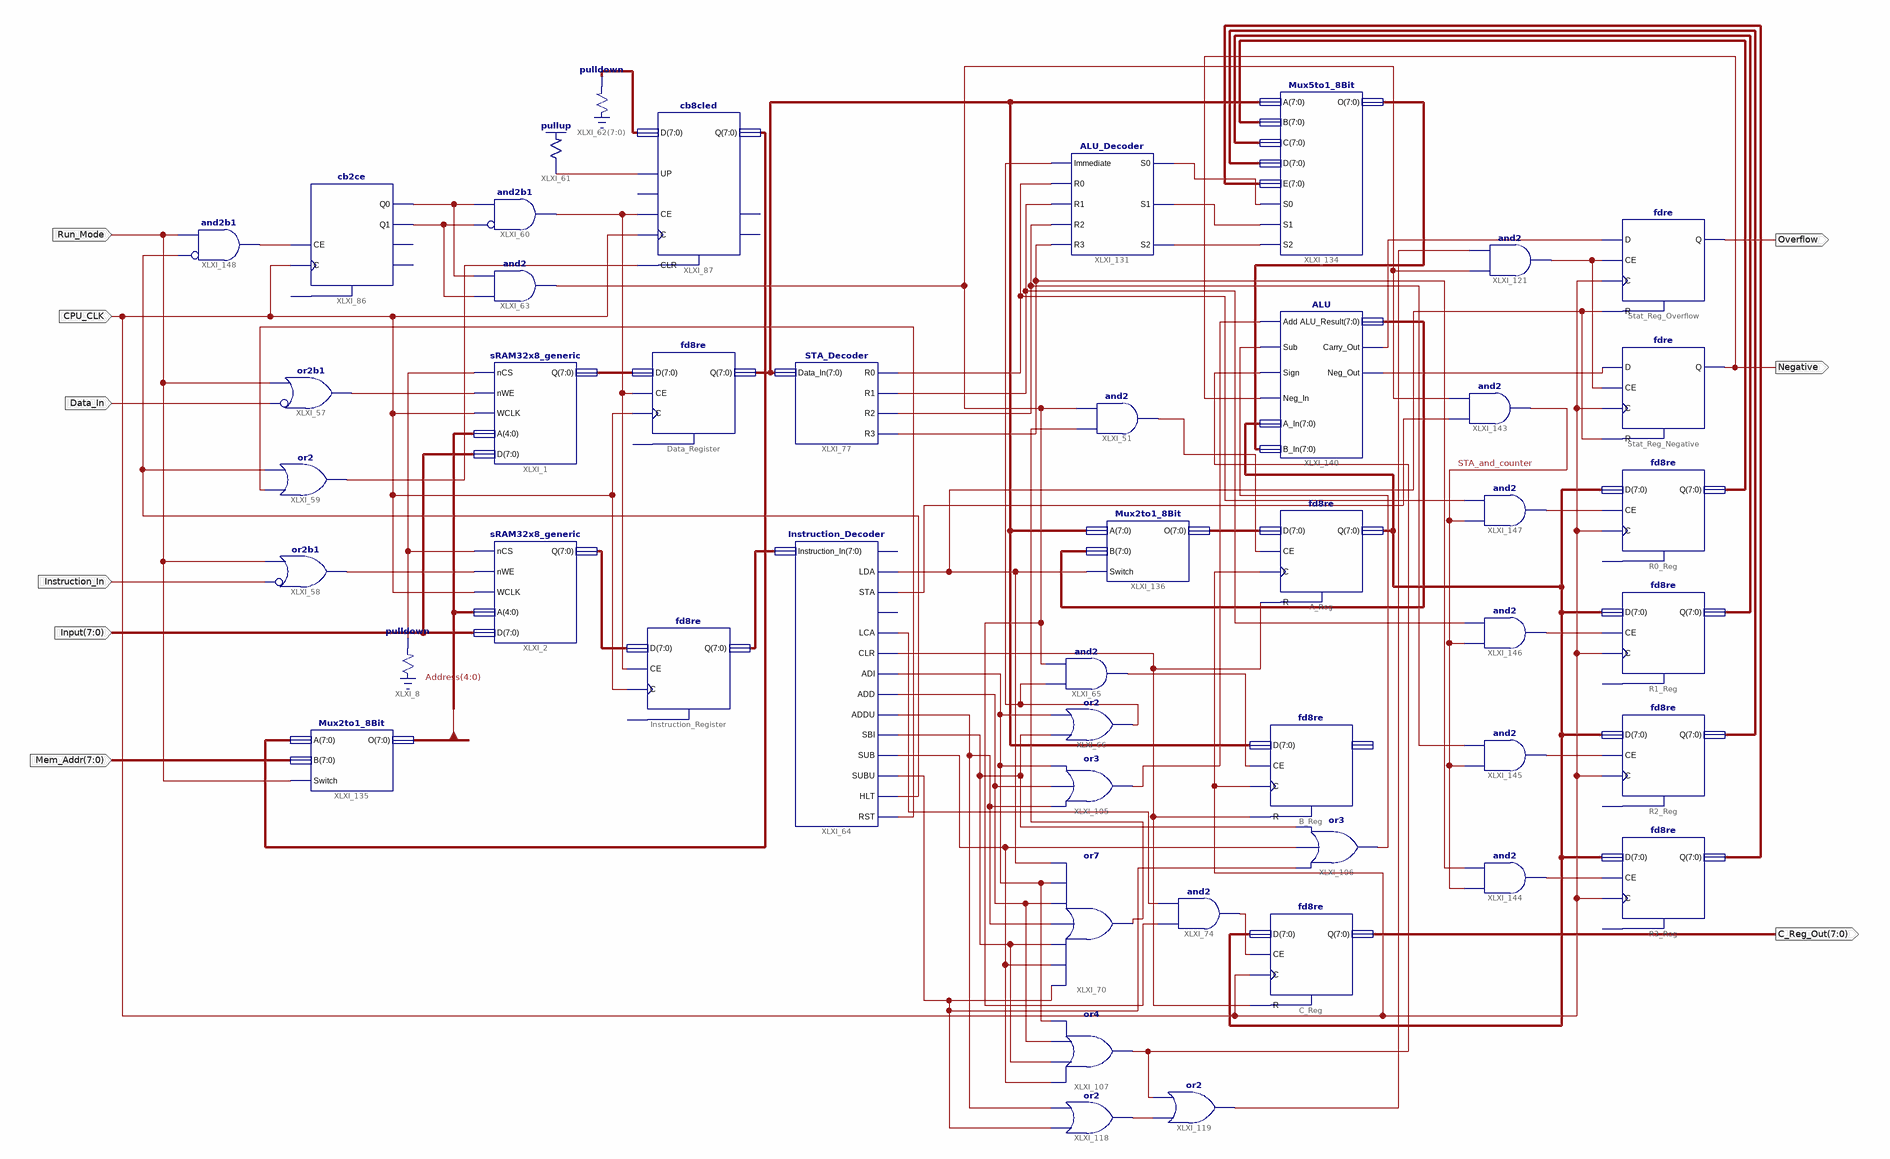
[diagram p0: schematic sheet 1]
// Xilinx ISE schematic CPU.sch (spartan3e) as structural Verilog: 47 symbols, 10 ports
module CPU (
  input  [7:0] Input,
  input  Instruction_In,
  input  Data_In,
  input  [7:0] Mem_Addr,
  input  Run_Mode,
  input  CPU_CLK,
  output [7:0] C_Reg_Out,
  output Overflow,
  output Negative,
  output XLXN_1065
);

  wire CPUCLK, S1, S2, STA_and_counter, XLXN_15, XLXN_16, XLXN_19, XLXN_50, XLXN_89, XLXN_95, XLXN_102,
       XLXN_103, XLXN_112, XLXN_113, XLXN_199, XLXN_200, XLXN_201, XLXN_202, XLXN_207, XLXN_210, XLXN_380,
       XLXN_449, XLXN_774, XLXN_805, XLXN_806, XLXN_807, XLXN_808, XLXN_809, XLXN_811, XLXN_825, XLXN_841,
       XLXN_842, XLXN_846, XLXN_848, XLXN_905, XLXN_939, XLXN_940, XLXN_941, XLXN_943, XLXN_971, XLXN_991,
       XLXN_992, XLXN_1018, XLXN_1023, XLXN_1053, XLXN_1059;
  wire [7:0] Address, Aout, Data_Out, O, To_ALU, XLXN_1, XLXN_2, XLXN_105, XLXN_802, XLXN_844, XLXN_933,
       XLXN_1049, XLXN_1051, XLXN_1087, XLXN_1090;

  fd8re B_Reg (.C(CPU_CLK), .CE(XLXN_207), .D(Data_Out), .R(XLXN_50));  // open: Q
  fd8re R1_Reg (.C(CPU_CLK), .CE(XLXN_201), .D(Aout), .Q(XLXN_1087));  // open: R
  and XLXI_51 (XLXN_199, XLXN_774, XLXN_1018);
  fd8re R0_Reg (.C(CPU_CLK), .CE(XLXN_200), .D(Aout), .Q(XLXN_1049));  // open: R
  fd8re R2_Reg (.C(CPU_CLK), .CE(XLXN_202), .D(Aout), .Q(XLXN_1051));  // open: R
  fd8re R3_Reg (.C(CPU_CLK), .CE(CPUCLK), .D(Aout), .Q(XLXN_1090));  // open: R
  \pulldown  XLXI_8 (.O(XLXN_19));
  or XLXI_57 (XLXN_15, ~Data_In, Run_Mode);  // or2b1
  or XLXI_58 (XLXN_16, ~Instruction_In, Run_Mode);  // or2b1
  STA_Decoder XLXI_77 (.Data_In(Data_Out), .R0(XLXN_940), .R3(XLXN_943), .R1(XLXN_941), .R2(XLXN_971));
  Mux5to1_8Bit XLXI_134 (
    .S0(XLXN_1065), .S1(S1), .S2(S2), .O(To_ALU), .E(XLXN_1090), .B(XLXN_1049), .C(XLXN_1087), .D(XLXN_1051),
    .A(Data_Out));
  ALU_Decoder XLXI_131 (
    .Immediate(XLXN_939), .R0(XLXN_940), .R1(XLXN_941), .R2(XLXN_971), .R3(XLXN_943), .S1(S1),
    .S0(XLXN_1065), .S2(S2));
  Instruction_Decoder XLXI_64 (
    .Instruction_In(XLXN_802), .RST(XLXN_811), .STA(XLXN_1059), .LCA(XLXN_992), .CLR(XLXN_50),
    .ADI(XLXN_380), .LDA(XLXN_1053), .ADD(XLXN_805), .ADDU(XLXN_806), .SUBU(XLXN_809), .HLT(XLXN_991),
    .SBI(XLXN_807), .SUB(XLXN_808));  // open: NOP, MVI
  and XLXI_65 (XLXN_207, XLXN_939, XLXN_1018);
  or XLXI_66 (XLXN_939, XLXN_807, XLXN_380);
  and XLXI_121 (XLXN_1023, XLXN_1018, XLXN_825);
  fdre Stat_Reg_Negative (.C(CPU_CLK), .CE(XLXN_1023), .D(XLXN_848), .R(XLXN_1053), .Q(Negative));
  fdre Stat_Reg_Overflow (.C(CPU_CLK), .CE(XLXN_1023), .D(XLXN_846), .R(XLXN_1053), .Q(Overflow));
  fd8re A_Reg (.C(CPU_CLK), .CE(XLXN_199), .D(O), .R(XLXN_50), .Q(Aout));
  or XLXI_59 (XLXN_95, XLXN_811, XLXN_991);
  or XLXI_106 (XLXN_841, XLXN_809, XLXN_808, XLXN_807);
  and XLXI_63 (XLXN_1018, XLXN_112, XLXN_113);
  and XLXI_60 (XLXN_102, ~XLXN_112, XLXN_113);  // and2b1
  \pullup  XLXI_61 (.O(XLXN_103));
  \pulldown  XLXI_62[7:0] (.O(XLXN_105));
  or XLXI_105 (XLXN_905, XLXN_806, XLXN_805, XLXN_380);
  or XLXI_70 (XLXN_774, XLXN_809, XLXN_808, XLXN_807, XLXN_806, XLXN_805, XLXN_380, XLXN_1053);
  or XLXI_107 (XLXN_842, XLXN_808, XLXN_807, XLXN_805, XLXN_380);
  or XLXI_118 (XLXN_449, XLXN_809, XLXN_806);
  or XLXI_119 (XLXN_825, XLXN_449, XLXN_842);
  and XLXI_74 (XLXN_210, XLXN_1018, XLXN_992);
  fd8re C_Reg (.C(CPU_CLK), .CE(XLXN_210), .D(Aout), .R(XLXN_50), .Q(C_Reg_Out));
  cb2ce XLXI_86 (.C(CPU_CLK), .CE(XLXN_89), .Q0(XLXN_113), .Q1(XLXN_112));  // open: CLR, CEO, TC
  cb8cled XLXI_87 (
    .C(CPU_CLK), .CE(XLXN_102), .CLR(XLXN_95), .D(XLXN_105), .UP(XLXN_103), .Q(XLXN_933));  // open: L, CEO, TC
  sRAM32x8_generic XLXI_1 (.nCS(XLXN_19), .nWE(XLXN_15), .WCLK(CPU_CLK), .A(Address[4:0]), .D(Input), .Q(XLXN_1));
  sRAM32x8_generic XLXI_2 (.nCS(XLXN_19), .nWE(XLXN_16), .WCLK(CPU_CLK), .A(Address[4:0]), .D(Input), .Q(XLXN_2));
  fd8re Instruction_Register (.C(CPU_CLK), .CE(XLXN_102), .D(XLXN_2), .Q(XLXN_802));  // open: R
  fd8re Data_Register (.C(CPU_CLK), .CE(XLXN_102), .D(XLXN_1), .Q(Data_Out));  // open: R
  Mux2to1_8Bit XLXI_135 (.B(Mem_Addr), .O(Address), .Switch(Run_Mode), .A(XLXN_933));
  Mux2to1_8Bit XLXI_136 (.B(XLXN_844), .O(O), .Switch(XLXN_1053), .A(Data_Out));
  ALU XLXI_140 (
    .Neg_In(Negative), .Sign(XLXN_842), .Sub(XLXN_841), .Add(XLXN_905), .A_In(Aout), .B_In(To_ALU),
    .ALU_Result(XLXN_844), .Carry_Out(XLXN_846), .Neg_Out(XLXN_848));
  and XLXI_143 (STA_and_counter, XLXN_1059, XLXN_1018);
  and XLXI_144 (CPUCLK, STA_and_counter, XLXN_943);
  and XLXI_145 (XLXN_202, STA_and_counter, XLXN_971);
  and XLXI_146 (XLXN_201, STA_and_counter, XLXN_941);
  and XLXI_147 (XLXN_200, STA_and_counter, XLXN_940);
  and XLXI_148 (XLXN_89, ~XLXN_991, Run_Mode);  // and2b1
endmodule
